# Altium schematic sheet MAIN.SchDoc
size A4; SheetNumber: 1; SheetTotal: 8
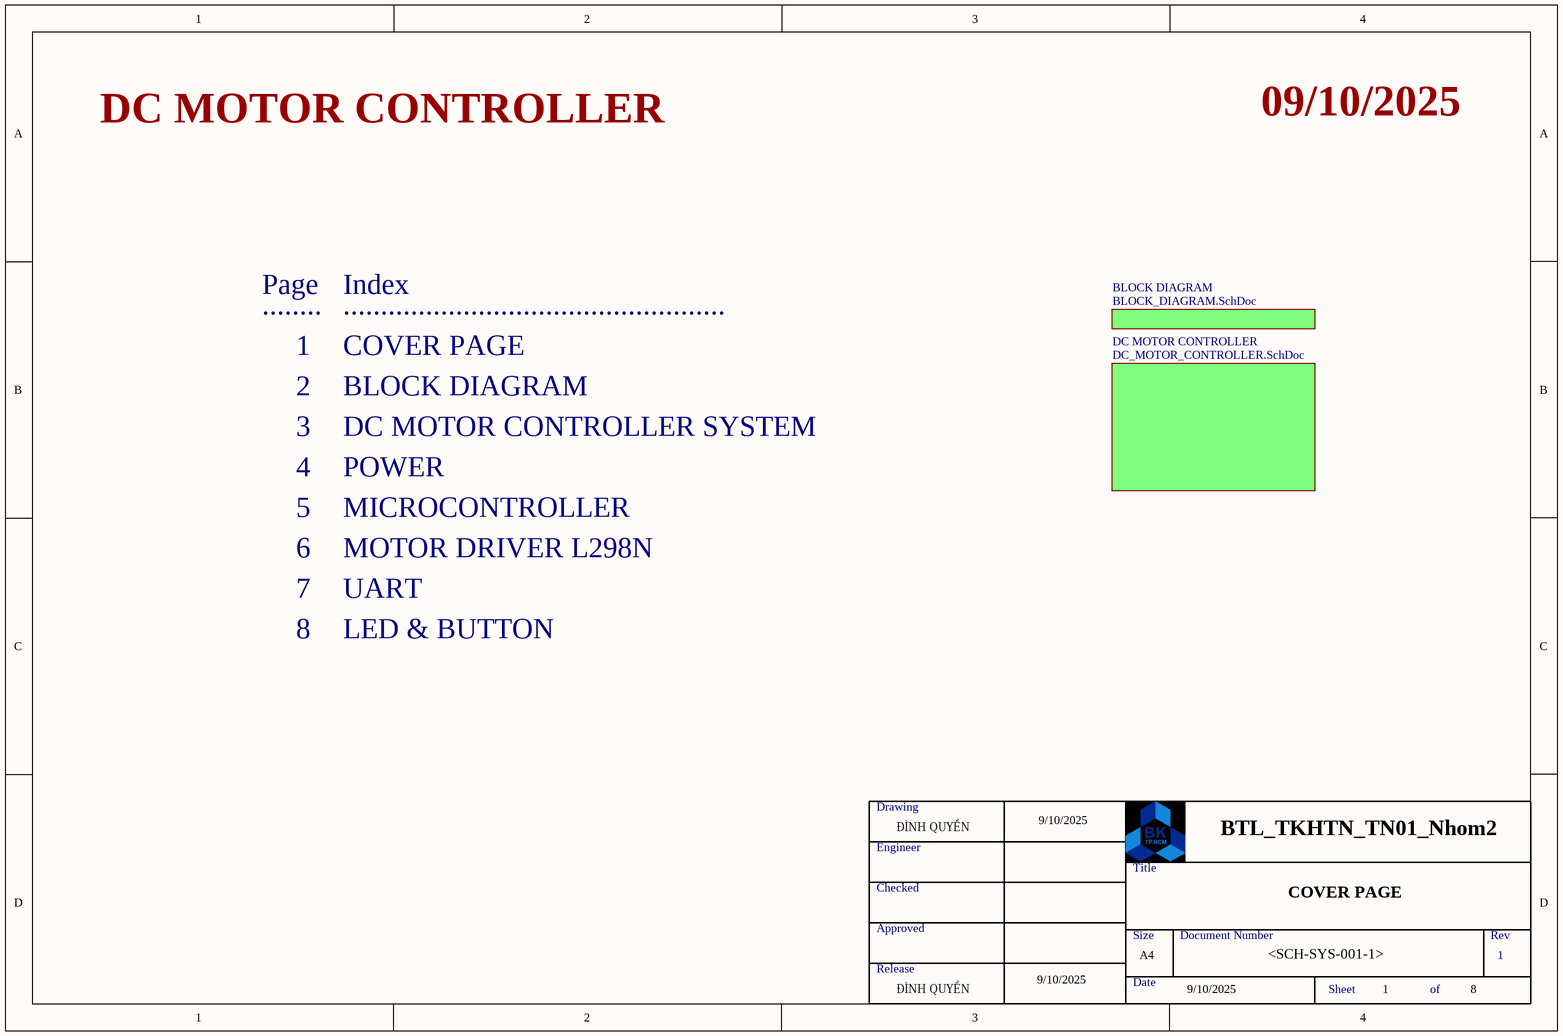
[diagram p0: MAIN.SchDoc]

## Sub-sheets
BLOCK DIAGRAM = BLOCK_DIAGRAM.SchDoc: no entries
DC MOTOR CONTROLLER = DC_MOTOR_CONTROLLER.SchDoc: no entries

## Notes on the sheet
- DC MOTOR CONTROLLER
- 09/10/2025
- Page
- Index
- ........
- 1
- ...................................................
- COVER PAGE
- 2
- 3
- BLOCK DIAGRAM
- DC MOTOR CONTROLLER SYSTEM
- 4
- 5
- POWER
- MICROCONTROLLER
- 6
- MOTOR DRIVER L298N
- 7
- 8
- UART
- LED & BUTTON
- Drawing
- Engineer
- ĐÌNH QUYỀN
- 9/10/2025
- BTL_TKHTN_TN01_Nhom2
- Checked
- Title
- Approved
- Release
- Size
- Date
- A4
- Document Number
- <SCH-SYS-001-1>
- Rev
- Sheet
- of